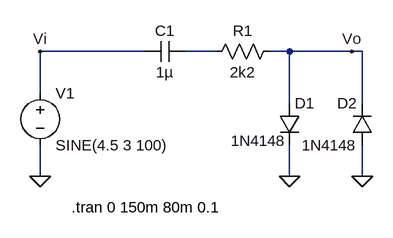
[diagram p0: schematic ClippingStage.asc]
ClippingStage.asc, the LTspice schematic file:
Version 4
SHEET 1 880 680
WIRE 0 96 -160 96
WIRE 112 96 64 96
WIRE 224 96 192 96
WIRE 320 96 224 96
WIRE 336 96 320 96
WIRE -160 160 -160 96
WIRE 224 176 224 96
WIRE 336 176 336 96
WIRE -160 288 -160 240
WIRE 224 288 224 240
WIRE 336 288 336 240
FLAG 224 288 0
FLAG 336 288 0
FLAG -160 288 0
FLAG 320 96 Vo
FLAG -160 96 Vi
SYMBOL cap 64 80 R90
WINDOW 0 0 32 VBottom 2
WINDOW 3 32 32 VTop 2
SYMATTR InstName C1
SYMATTR Value 1µ
SYMBOL res 208 80 R90
WINDOW 0 0 56 VBottom 2
WINDOW 3 32 56 VTop 2
SYMATTR InstName R1
SYMATTR Value 2k2
SYMBOL diode 208 176 R0
WINDOW 3 -74 57 Left 2
SYMATTR Value 1N4148
SYMATTR InstName D1
SYMBOL diode 352 240 R180
WINDOW 0 24 64 Left 2
WINDOW 3 24 0 Left 2
SYMATTR InstName D2
SYMATTR Value 1N4148
SYMBOL voltage -160 144 R0
WINDOW 123 24 124 Left 2
WINDOW 39 0 0 Left 0
SYMATTR InstName V1
SYMATTR Value SINE(4.5 3 100)
TEXT -112 336 Left 2 !.tran 0 150m 80m 0.1

The netlist it stands for:
* ClippingStage.asc
C1 N001 Vi 1µ
R1 Vo N001 2k2
D1 Vo 0 1N4148
D2 0 Vo 1N4148
V1 Vi 0 SINE(4.5 3 100)
.model D D
.lib standard.dio
.tran 0 150m 80m 0.1
.backanno
.end